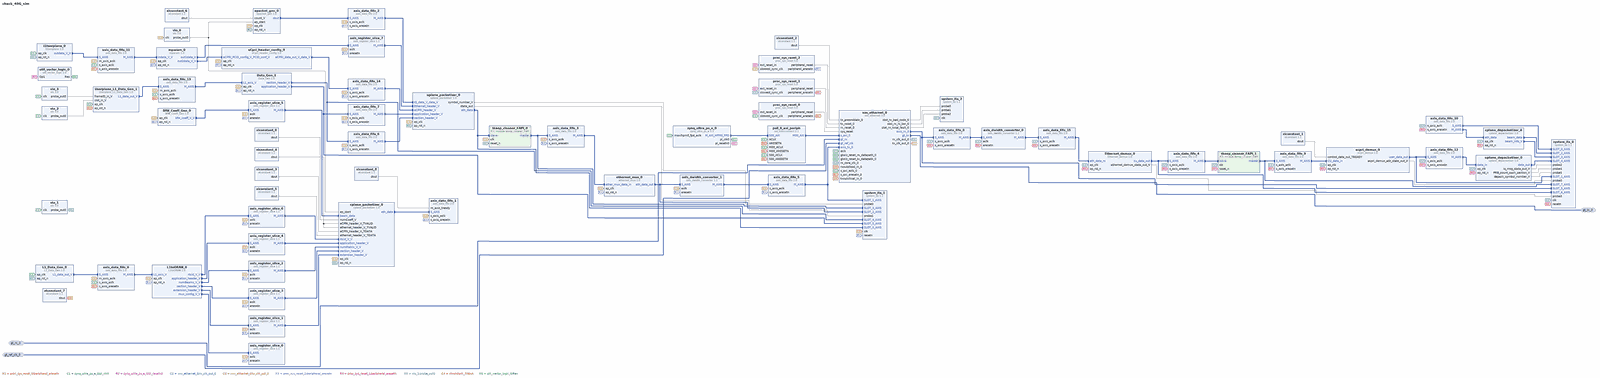
[diagram p0: block diagram of the top level, whole]
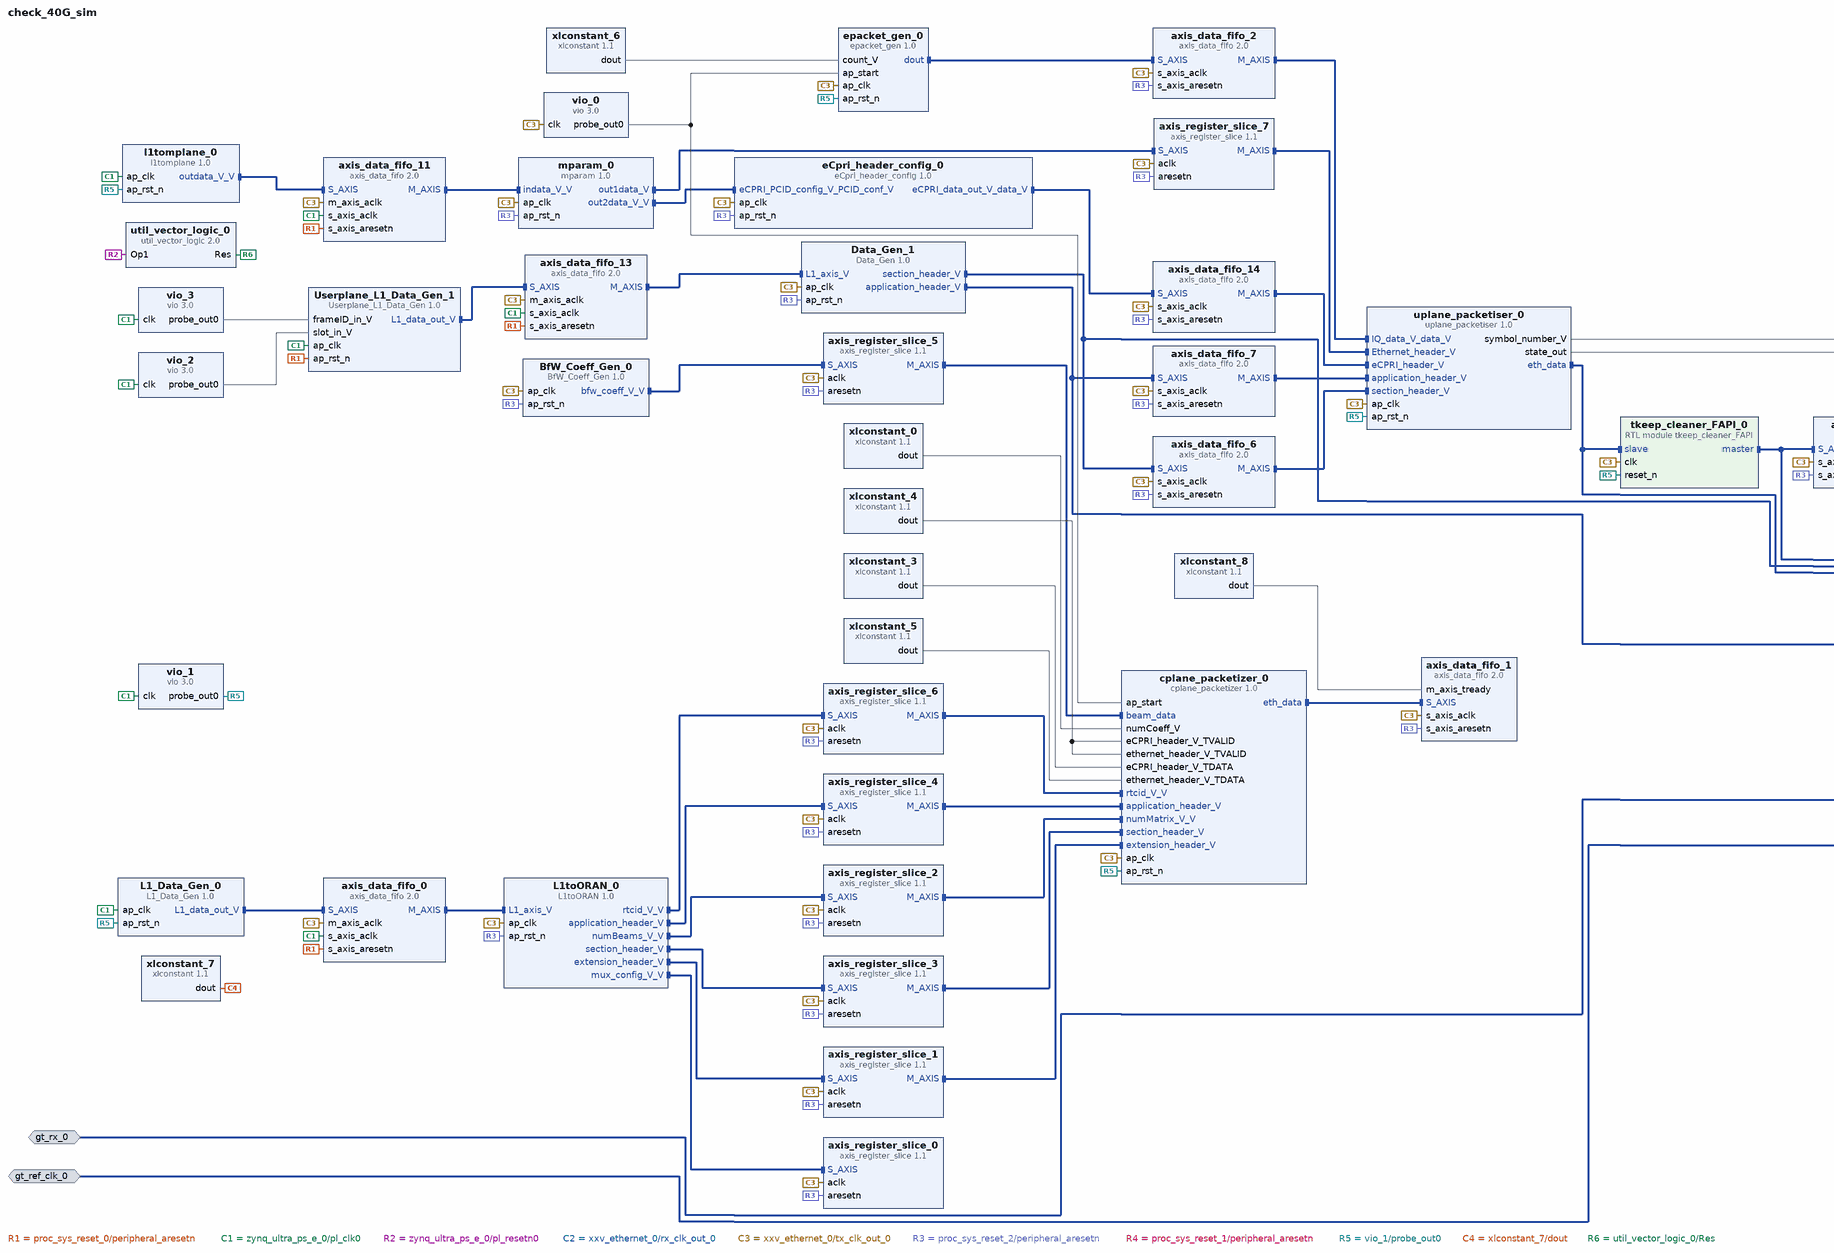
[diagram p1: block diagram of the top level, left part]
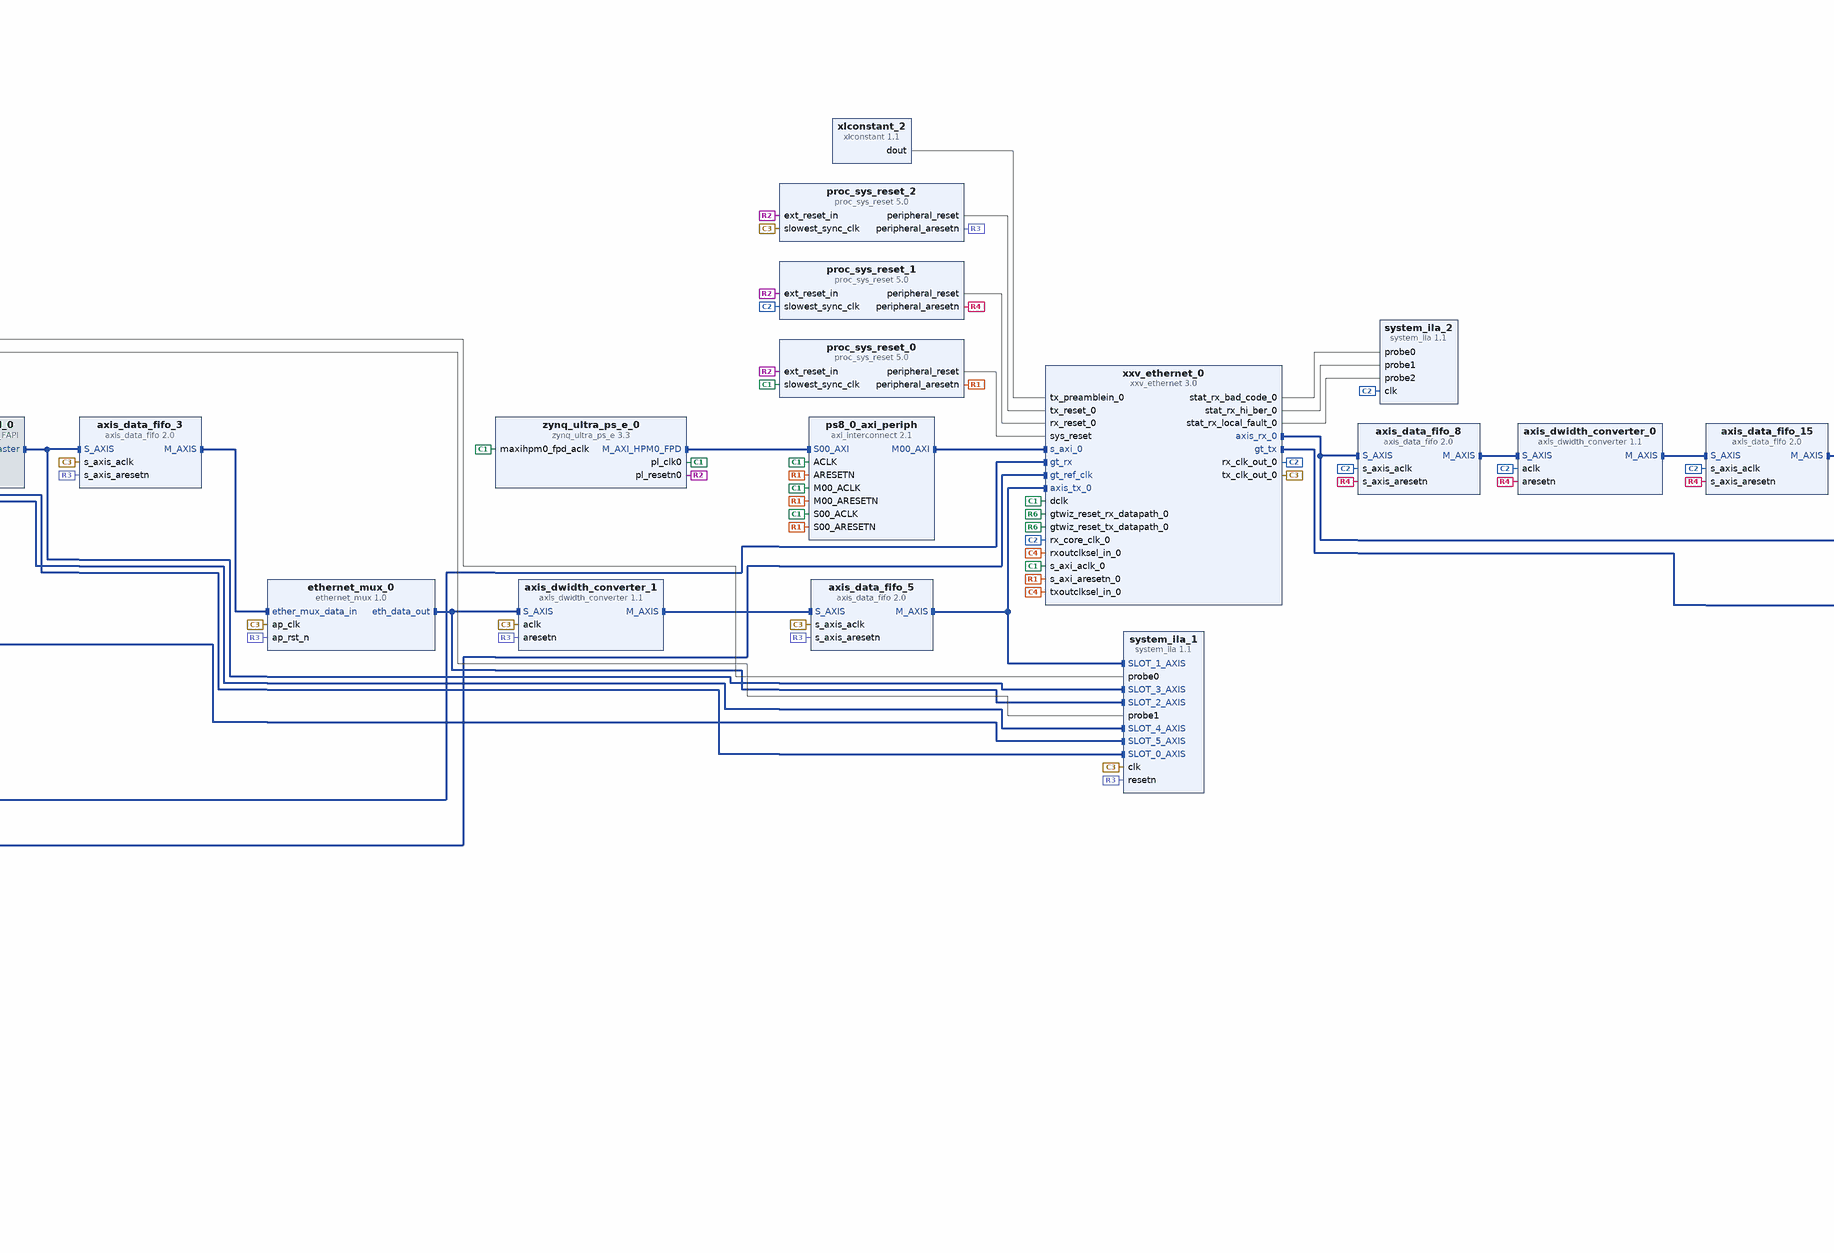
[diagram p2: block diagram of the top level, centre part]
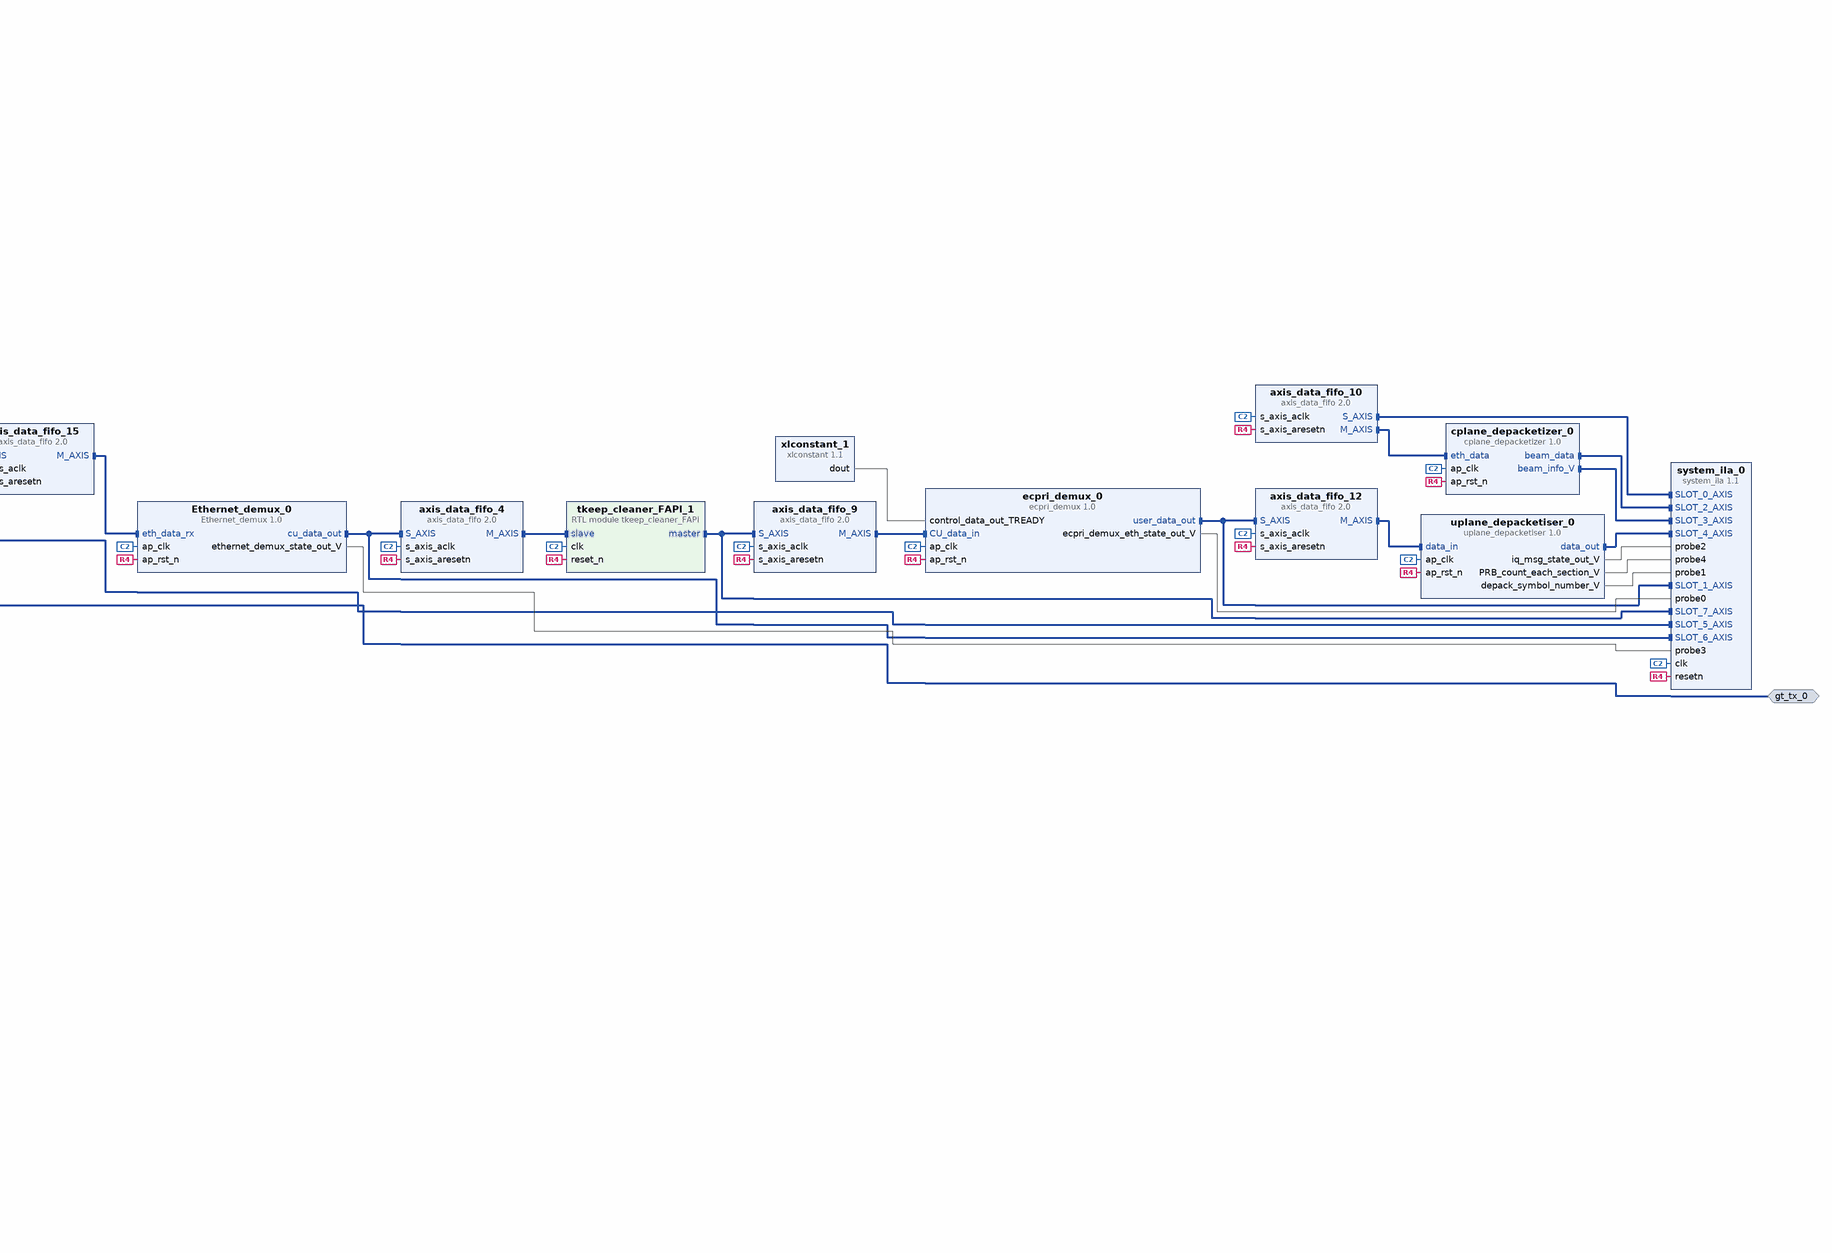
[diagram p3: block diagram of the top level, right part]
# Vivado block design check_40G_sim, xczu19eg-ffvd1760-3-e, Vivado 2019.1
create_bd_design check_40G_sim

create_bd_intf_port -mode Slave -vlnv xilinx.com:interface:diff_clock_rtl:1.0 gt_ref_clk_0
set_property -dict {CONFIG.FREQ_HZ 156250000} [get_bd_intf_ports gt_ref_clk_0]
create_bd_intf_port -mode Slave -vlnv xilinx.com:display_xxv_ethernet:gt_ports:2.0 gt_rx_0
create_bd_intf_port -mode Master -vlnv xilinx.com:display_xxv_ethernet:gt_ports:2.0 gt_tx_0

create_bd_cell -type ip -vlnv xilinx.com:ip:axis_data_fifo:2.0 axis_data_fifo_0
set_property -dict {CONFIG.FIFO_DEPTH 2048 CONFIG.IS_ACLK_ASYNC 1} [get_bd_cells axis_data_fifo_0]
create_bd_cell -type ip -vlnv xilinx.com:ip:axis_data_fifo:2.0 axis_data_fifo_11
set_property -dict {CONFIG.IS_ACLK_ASYNC 1} [get_bd_cells axis_data_fifo_11]
create_bd_cell -type ip -vlnv xilinx.com:ip:axis_data_fifo:2.0 axis_data_fifo_13
set_property -dict {CONFIG.IS_ACLK_ASYNC 1} [get_bd_cells axis_data_fifo_13]
create_bd_cell -type ip -vlnv xilinx.com:ip:axis_data_fifo:2.0 axis_data_fifo_14
create_bd_cell -type ip -vlnv xilinx.com:ip:axis_data_fifo:2.0 axis_data_fifo_1
set_property -dict {CONFIG.FIFO_DEPTH 4096 CONFIG.FIFO_MODE 1 CONFIG.HAS_TLAST 1} [get_bd_cells axis_data_fifo_1]
create_bd_cell -type ip -vlnv xilinx.com:ip:axis_data_fifo:2.0 axis_data_fifo_2
set_property -dict {CONFIG.FIFO_DEPTH 1024} [get_bd_cells axis_data_fifo_2]
create_bd_cell -type ip -vlnv xilinx.com:ip:axis_data_fifo:2.0 axis_data_fifo_3
set_property -dict {CONFIG.FIFO_DEPTH 4096 CONFIG.FIFO_MODE 1} [get_bd_cells axis_data_fifo_3]
create_bd_cell -type ip -vlnv xilinx.com:ip:axis_data_fifo:2.0 axis_data_fifo_6
set_property -dict {CONFIG.FIFO_DEPTH 1024} [get_bd_cells axis_data_fifo_6]
create_bd_cell -type ip -vlnv xilinx.com:ip:axis_data_fifo:2.0 axis_data_fifo_7
set_property -dict {CONFIG.FIFO_DEPTH 1024} [get_bd_cells axis_data_fifo_7]
create_bd_cell -type ip -vlnv xilinx.com:ip:axis_data_fifo:2.0 axis_data_fifo_9
set_property -dict {CONFIG.FIFO_DEPTH 512} [get_bd_cells axis_data_fifo_9]
create_bd_cell -type ip -vlnv xilinx.com:ip:axis_dwidth_converter:1.1 axis_dwidth_converter_1
set_property -dict [list \
  CONFIG.HAS_MI_TKEEP 0 \
  CONFIG.HAS_TKEEP 1 \
  CONFIG.HAS_TLAST 1 \
  CONFIG.M_TDATA_NUM_BYTES 8 \
  CONFIG.S_TDATA_NUM_BYTES 16 \
  CONFIG.TUSER_BITS_PER_BYTE 1 \
] [get_bd_cells axis_dwidth_converter_1]
create_bd_cell -type ip -vlnv xilinx.com:ip:axis_register_slice:1.1 axis_register_slice_0
create_bd_cell -type ip -vlnv xilinx.com:ip:axis_register_slice:1.1 axis_register_slice_1
create_bd_cell -type ip -vlnv xilinx.com:ip:axis_register_slice:1.1 axis_register_slice_2
create_bd_cell -type ip -vlnv xilinx.com:ip:axis_register_slice:1.1 axis_register_slice_3
create_bd_cell -type ip -vlnv xilinx.com:ip:axis_register_slice:1.1 axis_register_slice_4
create_bd_cell -type ip -vlnv xilinx.com:ip:axis_register_slice:1.1 axis_register_slice_5
create_bd_cell -type ip -vlnv xilinx.com:ip:axis_register_slice:1.1 axis_register_slice_6
create_bd_cell -type ip -vlnv xilinx.com:ip:axis_register_slice:1.1 axis_register_slice_7
create_bd_cell -type ip -vlnv xilinx.com:hls:epacket_gen:1.0 epacket_gen_0
create_bd_cell -type ip -vlnv xilinx.com:ip:proc_sys_reset:5.0 proc_sys_reset_0
create_bd_cell -type ip -vlnv xilinx.com:ip:proc_sys_reset:5.0 proc_sys_reset_1
create_bd_cell -type ip -vlnv xilinx.com:ip:proc_sys_reset:5.0 proc_sys_reset_2
create_bd_cell -type ip -vlnv xilinx.com:ip:axi_interconnect:2.1 ps8_0_axi_periph
set_property -dict {CONFIG.NUM_MI 1} [get_bd_cells ps8_0_axi_periph]
create_bd_cell -type ip -vlnv xilinx.com:ip:util_vector_logic:2.0 util_vector_logic_0
set_property -dict {CONFIG.C_OPERATION not CONFIG.C_SIZE 1} [get_bd_cells util_vector_logic_0]
create_bd_cell -type ip -vlnv xilinx.com:ip:vio:3.0 vio_0
set_property -dict {CONFIG.C_NUM_PROBE_IN 0} [get_bd_cells vio_0]
create_bd_cell -type ip -vlnv xilinx.com:ip:vio:3.0 vio_1
set_property -dict {CONFIG.C_NUM_PROBE_IN 0} [get_bd_cells vio_1]
create_bd_cell -type ip -vlnv xilinx.com:ip:xlconstant:1.1 xlconstant_0
set_property -dict {CONFIG.CONST_VAL 16 CONFIG.CONST_WIDTH 5} [get_bd_cells xlconstant_0]
create_bd_cell -type ip -vlnv xilinx.com:ip:xlconstant:1.1 xlconstant_3
set_property -dict {CONFIG.CONST_VAL 0x00000100000200 CONFIG.CONST_WIDTH 64} [get_bd_cells xlconstant_3]
create_bd_cell -type ip -vlnv xilinx.com:ip:xlconstant:1.1 xlconstant_4
create_bd_cell -type ip -vlnv xilinx.com:ip:xlconstant:1.1 xlconstant_5
set_property -dict {CONFIG.CONST_VAL 0xaefe000a35000001ffffffffffff CONFIG.CONST_WIDTH 112} [get_bd_cells xlconstant_5]
create_bd_cell -type ip -vlnv xilinx.com:ip:xlconstant:1.1 xlconstant_6
set_property -dict {CONFIG.CONST_VAL 100 CONFIG.CONST_WIDTH 16} [get_bd_cells xlconstant_6]
create_bd_cell -type ip -vlnv xilinx.com:ip:zynq_ultra_ps_e:3.3 zynq_ultra_ps_e_0
set_property -dict [list \
  CONFIG.PSU__DDRC__ENABLE 0 \
  CONFIG.PSU__DDR_HIGH_ADDRESS_GUI_ENABLE 0 \
  CONFIG.PSU__DDR__INTERFACE__FREQMHZ 333.333 \
  CONFIG.PSU__MAXIGP0__DATA_WIDTH 128 \
  CONFIG.PSU__PSS_REF_CLK__FREQMHZ 50 \
  CONFIG.PSU__UART0__BAUD_RATE 115200 \
  CONFIG.PSU__UART0__MODEM__ENABLE 0 \
  CONFIG.PSU__UART0__PERIPHERAL__ENABLE 1 \
  CONFIG.PSU__UART0__PERIPHERAL__IO {MIO 18 .. 19} \
  CONFIG.PSU__USE__M_AXI_GP0 1 \
  CONFIG.PSU__USE__M_AXI_GP2 0 \
  CONFIG.SUBPRESET1 Custom \
] [get_bd_cells zynq_ultra_ps_e_0]
# 47 more settings of zynq_ultra_ps_e_0 are not shown: defaults, MIO pin electricals, DDR timing, and values the tool derives
create_bd_cell -type ip -vlnv xilinx.com:hls:BfW_Coeff_Gen:1.0 BfW_Coeff_Gen_0
create_bd_cell -type ip -vlnv xilinx.com:hls:L1_Data_Gen:1.0 L1_Data_Gen_0
create_bd_cell -type ip -vlnv xilinx.com:hls:cplane_packetizer:1.0 cplane_packetizer_0
create_bd_cell -type ip -vlnv xilinx.com:ip:system_ila:1.1 system_ila_0
set_property -dict [list \
  CONFIG.ALL_PROBE_SAME_MU_CNT 2 \
  CONFIG.C_DATA_DEPTH 4096 \
  CONFIG.C_EN_STRG_QUAL 1 \
  CONFIG.C_MON_TYPE MIX \
  CONFIG.C_NUM_MONITOR_SLOTS 8 \
  CONFIG.C_NUM_OF_PROBES 5 \
  CONFIG.C_PROBE0_MU_CNT 2 \
  CONFIG.C_PROBE1_MU_CNT 2 \
  CONFIG.C_PROBE2_MU_CNT 2 \
  CONFIG.C_PROBE3_MU_CNT 2 \
  CONFIG.C_PROBE4_MU_CNT 2 \
  CONFIG.C_PROBE5_MU_CNT 2 \
  CONFIG.C_SLOT 7 \
  CONFIG.C_SLOT_0_INTF_TYPE xilinx.com:interface:axis_rtl:1.0 \
  CONFIG.C_SLOT_1_INTF_TYPE xilinx.com:interface:axis_rtl:1.0 \
  CONFIG.C_SLOT_2_INTF_TYPE xilinx.com:interface:axis_rtl:1.0 \
  CONFIG.C_SLOT_3_INTF_TYPE xilinx.com:interface:axis_rtl:1.0 \
  CONFIG.C_SLOT_4_INTF_TYPE xilinx.com:interface:axis_rtl:1.0 \
  CONFIG.C_SLOT_5_INTF_TYPE xilinx.com:interface:axis_rtl:1.0 \
  CONFIG.C_SLOT_6_INTF_TYPE xilinx.com:interface:axis_rtl:1.0 \
  CONFIG.C_SLOT_7_INTF_TYPE xilinx.com:interface:axis_rtl:1.0 \
] [get_bd_cells system_ila_0]
create_bd_cell -type ip -vlnv xilinx.com:hls:cplane_depacketizer:1.0 cplane_depacketizer_0
create_bd_cell -type ip -vlnv xilinx.com:ip:axis_data_fifo:2.0 axis_data_fifo_10
set_property -dict {CONFIG.FIFO_DEPTH 1024} [get_bd_cells axis_data_fifo_10]
create_bd_cell -type ip -vlnv xilinx.com:ip:axis_data_fifo:2.0 axis_data_fifo_12
set_property -dict {CONFIG.FIFO_DEPTH 1024} [get_bd_cells axis_data_fifo_12]
create_bd_cell -type ip -vlnv xilinx.com:ip:xxv_ethernet:3.0 xxv_ethernet_0
set_property -dict [list \
  CONFIG.BASE_R_KR BASE-R \
  CONFIG.ENABLE_PIPELINE_REG 1 \
  CONFIG.GT_GROUP_SELECT Quad_X0Y3 \
  CONFIG.GT_REF_CLK_FREQ 156.25 \
  CONFIG.GT_TYPE GTH \
  CONFIG.INCLUDE_AXI4_INTERFACE 1 \
  CONFIG.INCLUDE_STATISTICS_COUNTERS 1 \
  CONFIG.INS_LOSS_NYQ 10 \
  CONFIG.LANE1_GT_LOC X0Y12 \
  CONFIG.LINE_RATE 10 \
] [get_bd_cells xxv_ethernet_0]
create_bd_cell -type ip -vlnv xilinx.com:ip:axis_data_fifo:2.0 axis_data_fifo_5
set_property -dict {CONFIG.FIFO_DEPTH 4096 CONFIG.FIFO_MODE 2} [get_bd_cells axis_data_fifo_5]
create_bd_cell -type ip -vlnv xilinx.com:ip:xlconstant:1.1 xlconstant_2
set_property -dict {CONFIG.CONST_VAL 0 CONFIG.CONST_WIDTH 56} [get_bd_cells xlconstant_2]
create_bd_cell -type ip -vlnv xilinx.com:ip:axis_dwidth_converter:1.1 axis_dwidth_converter_0
set_property -dict {CONFIG.M_TDATA_NUM_BYTES 16 CONFIG.S_TDATA_NUM_BYTES 8} [get_bd_cells axis_dwidth_converter_0]
create_bd_cell -type ip -vlnv xilinx.com:ip:axis_data_fifo:2.0 axis_data_fifo_8
set_property -dict {CONFIG.FIFO_DEPTH 1024} [get_bd_cells axis_data_fifo_8]
create_bd_cell -type ip -vlnv xilinx.com:ip:xlconstant:1.1 xlconstant_7
set_property -dict {CONFIG.CONST_VAL 5 CONFIG.CONST_WIDTH 3} [get_bd_cells xlconstant_7]
create_bd_cell -type ip -vlnv xilinx.com:ip:system_ila:1.1 system_ila_1
set_property -dict [list \
  CONFIG.ALL_PROBE_SAME_MU_CNT 2 \
  CONFIG.C_DATA_DEPTH 4096 \
  CONFIG.C_EN_STRG_QUAL 1 \
  CONFIG.C_MON_TYPE MIX \
  CONFIG.C_NUM_MONITOR_SLOTS 6 \
  CONFIG.C_NUM_OF_PROBES 2 \
  CONFIG.C_PROBE0_MU_CNT 2 \
  CONFIG.C_PROBE1_MU_CNT 2 \
  CONFIG.C_PROBE2_MU_CNT 2 \
  CONFIG.C_PROBE3_MU_CNT 2 \
  CONFIG.C_SLOT 5 \
  CONFIG.C_SLOT_0_INTF_TYPE xilinx.com:interface:axis_rtl:1.0 \
  CONFIG.C_SLOT_1_INTF_TYPE xilinx.com:interface:axis_rtl:1.0 \
  CONFIG.C_SLOT_2_INTF_TYPE xilinx.com:interface:axis_rtl:1.0 \
  CONFIG.C_SLOT_3_INTF_TYPE xilinx.com:interface:axis_rtl:1.0 \
  CONFIG.C_SLOT_4_INTF_TYPE xilinx.com:interface:axis_rtl:1.0 \
  CONFIG.C_SLOT_5_INTF_TYPE xilinx.com:interface:axis_rtl:1.0 \
] [get_bd_cells system_ila_1]
create_bd_cell -type ip -vlnv xilinx.com:hls:L1toORAN:1.0 L1toORAN_0
create_bd_cell -type ip -vlnv xilinx.com:hls:ecpri_demux:1.0 ecpri_demux_0
create_bd_cell -type ip -vlnv xilinx.com:ip:system_ila:1.1 system_ila_2
set_property -dict {CONFIG.C_MON_TYPE NATIVE CONFIG.C_NUM_OF_PROBES 3} [get_bd_cells system_ila_2]
create_bd_cell -type ip -vlnv xilinx.com:ip:xlconstant:1.1 xlconstant_8
create_bd_cell -type module -reference tkeep_cleaner_FAPI tkeep_cleaner_FAPI_0
create_bd_cell -type module -reference tkeep_cleaner_FAPI tkeep_cleaner_FAPI_1
create_bd_cell -type ip -vlnv xilinx.com:ip:axis_data_fifo:2.0 axis_data_fifo_4
set_property -dict [list \
  CONFIG.FIFO_DEPTH 1024 \
  CONFIG.HAS_TKEEP 1 \
  CONFIG.HAS_TLAST 1 \
  CONFIG.TDATA_NUM_BYTES 16 \
] [get_bd_cells axis_data_fifo_4]
create_bd_cell -type ip -vlnv xilinx.com:ip:xlconstant:1.1 xlconstant_1
create_bd_cell -type ip -vlnv xilinx.com:ip:axis_data_fifo:2.0 axis_data_fifo_15
set_property -dict {CONFIG.FIFO_DEPTH 1024} [get_bd_cells axis_data_fifo_15]
create_bd_cell -type ip -vlnv xilinx.com:hls:Ethernet_demux:1.0 Ethernet_demux_0
create_bd_cell -type ip -vlnv xilinx.com:hls:ethernet_mux:1.0 ethernet_mux_0
create_bd_cell -type ip -vlnv xilinx.com:hls:uplane_depacketiser:1.0 uplane_depacketiser_0
create_bd_cell -type ip -vlnv xilinx.com:hls:Userplane_L1_Data_Gen:1.0 Userplane_L1_Data_Gen_1
create_bd_cell -type ip -vlnv xilinx.com:hls:eCpri_header_config:1.0 eCpri_header_config_0
create_bd_cell -type ip -vlnv xilinx.com:hls:l1tomplane:1.0 l1tomplane_0
create_bd_cell -type ip -vlnv xilinx.com:hls:mparam:1.0 mparam_0
create_bd_cell -type ip -vlnv xilinx.com:hls:Data_Gen:1.0 Data_Gen_1
create_bd_cell -type ip -vlnv xilinx.com:hls:uplane_packetiser:1.0 uplane_packetiser_0
create_bd_cell -type ip -vlnv xilinx.com:ip:vio:3.0 vio_2
set_property -dict {CONFIG.C_NUM_PROBE_IN 0 CONFIG.C_PROBE_OUT0_WIDTH 6} [get_bd_cells vio_2]
create_bd_cell -type ip -vlnv xilinx.com:ip:vio:3.0 vio_3
set_property -dict {CONFIG.C_NUM_PROBE_IN 0 CONFIG.C_PROBE_OUT0_WIDTH 8} [get_bd_cells vio_3]

# ---- connections ----

connect_bd_intf_net [get_bd_intf_pins tkeep_cleaner_FAPI_1/master] [get_bd_intf_pins axis_data_fifo_9/S_AXIS]
connect_bd_intf_net [get_bd_intf_pins tkeep_cleaner_FAPI_1/master] [get_bd_intf_pins system_ila_0/SLOT_7_AXIS]
connect_bd_intf_net [get_bd_intf_pins tkeep_cleaner_FAPI_0/master] [get_bd_intf_pins axis_data_fifo_3/S_AXIS]
connect_bd_intf_net [get_bd_intf_pins tkeep_cleaner_FAPI_0/master] [get_bd_intf_pins system_ila_1/SLOT_3_AXIS]
connect_bd_intf_net [get_bd_intf_pins axis_data_fifo_4/M_AXIS] [get_bd_intf_pins tkeep_cleaner_FAPI_1/slave]
connect_bd_intf_net [get_bd_intf_pins L1_Data_Gen_0/L1_data_out_V] [get_bd_intf_pins axis_data_fifo_0/S_AXIS]
connect_bd_intf_net [get_bd_intf_pins BfW_Coeff_Gen_0/bfw_coeff_V_V] [get_bd_intf_pins axis_register_slice_5/S_AXIS]
connect_bd_intf_net [get_bd_intf_pins ethernet_mux_0/eth_data_out] [get_bd_intf_pins axis_dwidth_converter_1/S_AXIS]
connect_bd_intf_net [get_bd_intf_pins ethernet_mux_0/eth_data_out] [get_bd_intf_pins system_ila_1/SLOT_2_AXIS]
connect_bd_intf_net [get_bd_intf_pins mparam_0/out2data_V_V] [get_bd_intf_pins eCpri_header_config_0/eCPRI_PCID_config_V_PCID_conf_V]
connect_bd_intf_net [get_bd_intf_pins l1tomplane_0/outdata_V_V] [get_bd_intf_pins axis_data_fifo_11/S_AXIS]
connect_bd_intf_net [get_bd_intf_pins axis_data_fifo_11/M_AXIS] [get_bd_intf_pins mparam_0/indata_V_V]
connect_bd_intf_net [get_bd_intf_pins L1toORAN_0/section_header_V] [get_bd_intf_pins axis_register_slice_3/S_AXIS]
connect_bd_intf_net [get_bd_intf_pins axis_register_slice_7/M_AXIS] [get_bd_intf_pins uplane_packetiser_0/Ethernet_header_V]
connect_bd_intf_net [get_bd_intf_pins uplane_packetiser_0/application_header_V] [get_bd_intf_pins axis_data_fifo_7/M_AXIS]
connect_bd_intf_net [get_bd_intf_pins cplane_packetizer_0/eth_data] [get_bd_intf_pins axis_data_fifo_1/S_AXIS]
connect_bd_intf_net -intf_net Data_Gen_1_application_header [get_bd_intf_pins axis_data_fifo_6/S_AXIS] [get_bd_intf_pins Data_Gen_1/section_header_V]
connect_bd_intf_net [get_bd_intf_pins axis_data_fifo_6/S_AXIS] [get_bd_intf_pins system_ila_1/SLOT_4_AXIS]
connect_bd_intf_net [get_bd_intf_pins axis_dwidth_converter_0/M_AXIS] [get_bd_intf_pins axis_data_fifo_15/S_AXIS]
connect_bd_intf_net -intf_net Data_Gen_1_section_header [get_bd_intf_pins axis_data_fifo_7/S_AXIS] [get_bd_intf_pins Data_Gen_1/application_header_V]
connect_bd_intf_net [get_bd_intf_pins axis_data_fifo_7/S_AXIS] [get_bd_intf_pins system_ila_1/SLOT_5_AXIS]
connect_bd_intf_net [get_bd_intf_pins uplane_packetiser_0/section_header_V] [get_bd_intf_pins axis_data_fifo_6/M_AXIS]
connect_bd_intf_net [get_bd_intf_pins L1toORAN_0/numBeams_V_V] [get_bd_intf_pins axis_register_slice_2/S_AXIS]
connect_bd_intf_net [get_bd_intf_pins ps8_0_axi_periph/M00_AXI] [get_bd_intf_pins xxv_ethernet_0/s_axi_0]
connect_bd_intf_net [get_bd_intf_pins ecpri_demux_0/user_data_out] [get_bd_intf_pins axis_data_fifo_12/S_AXIS]
connect_bd_intf_net [get_bd_intf_pins ecpri_demux_0/user_data_out] [get_bd_intf_pins system_ila_0/SLOT_1_AXIS]
connect_bd_intf_net [get_bd_intf_pins axis_data_fifo_12/M_AXIS] [get_bd_intf_pins uplane_depacketiser_0/data_in]
connect_bd_intf_net [get_bd_intf_pins zynq_ultra_ps_e_0/M_AXI_HPM0_FPD] [get_bd_intf_pins ps8_0_axi_periph/S00_AXI]
connect_bd_intf_net [get_bd_intf_pins L1toORAN_0/rtcid_V_V] [get_bd_intf_pins axis_register_slice_6/S_AXIS]
connect_bd_intf_net [get_bd_intf_pins mparam_0/out1data_V] [get_bd_intf_pins axis_register_slice_7/S_AXIS]
connect_bd_intf_net [get_bd_intf_pins axis_register_slice_6/M_AXIS] [get_bd_intf_pins cplane_packetizer_0/rtcid_V_V]
connect_bd_intf_net [get_bd_intf_pins axis_data_fifo_14/M_AXIS] [get_bd_intf_pins uplane_packetiser_0/eCPRI_header_V]
connect_bd_intf_net [get_bd_intf_pins axis_data_fifo_9/M_AXIS] [get_bd_intf_pins ecpri_demux_0/CU_data_in]
connect_bd_intf_net [get_bd_intf_pins axis_register_slice_2/M_AXIS] [get_bd_intf_pins cplane_packetizer_0/numMatrix_V_V]
connect_bd_intf_net [get_bd_intf_pins eCpri_header_config_0/eCPRI_data_out_V_data_V] [get_bd_intf_pins axis_data_fifo_14/S_AXIS]
connect_bd_intf_net -intf_net ecpri_demux_0_control_data_out [get_bd_intf_pins axis_data_fifo_10/S_AXIS] [get_bd_intf_pins system_ila_0/SLOT_0_AXIS]
connect_bd_intf_net [get_bd_intf_pins cplane_depacketizer_0/beam_data] [get_bd_intf_pins system_ila_0/SLOT_2_AXIS]
connect_bd_intf_net [get_bd_intf_pins axis_data_fifo_15/M_AXIS] [get_bd_intf_pins Ethernet_demux_0/eth_data_rx]
connect_bd_intf_net [get_bd_intf_pins axis_data_fifo_8/M_AXIS] [get_bd_intf_pins axis_dwidth_converter_0/S_AXIS]
connect_bd_intf_net [get_bd_intf_pins cplane_depacketizer_0/beam_info_V] [get_bd_intf_pins system_ila_0/SLOT_3_AXIS]
connect_bd_intf_net [get_bd_intf_pins axis_data_fifo_10/M_AXIS] [get_bd_intf_pins cplane_depacketizer_0/eth_data]
connect_bd_intf_net [get_bd_intf_pins uplane_depacketiser_0/data_out] [get_bd_intf_pins system_ila_0/SLOT_4_AXIS]
connect_bd_intf_net [get_bd_intf_pins L1toORAN_0/extension_header_V] [get_bd_intf_pins axis_register_slice_1/S_AXIS]
connect_bd_intf_net [get_bd_intf_pins axis_register_slice_4/M_AXIS] [get_bd_intf_pins cplane_packetizer_0/application_header_V]
connect_bd_intf_net [get_bd_intf_pins axis_data_fifo_0/M_AXIS] [get_bd_intf_pins L1toORAN_0/L1_axis_V]
connect_bd_intf_net [get_bd_intf_pins Userplane_L1_Data_Gen_1/L1_data_out_V] [get_bd_intf_pins axis_data_fifo_13/S_AXIS]
connect_bd_intf_net [get_bd_intf_pins axis_data_fifo_5/M_AXIS] [get_bd_intf_pins xxv_ethernet_0/axis_tx_0]
connect_bd_intf_net [get_bd_intf_pins axis_data_fifo_5/M_AXIS] [get_bd_intf_pins system_ila_1/SLOT_1_AXIS]
connect_bd_intf_net [get_bd_intf_pins xxv_ethernet_0/axis_rx_0] [get_bd_intf_pins axis_data_fifo_8/S_AXIS]
connect_bd_intf_net [get_bd_intf_pins xxv_ethernet_0/axis_rx_0] [get_bd_intf_pins system_ila_0/SLOT_5_AXIS]
connect_bd_intf_net [get_bd_intf_ports gt_tx_0] [get_bd_intf_pins xxv_ethernet_0/gt_tx]
connect_bd_intf_net -intf_net gt_rx_0_1 [get_bd_intf_ports gt_rx_0] [get_bd_intf_pins xxv_ethernet_0/gt_rx]
connect_bd_intf_net -intf_net gt_ref_clk_0_1 [get_bd_intf_ports gt_ref_clk_0] [get_bd_intf_pins xxv_ethernet_0/gt_ref_clk]
connect_bd_intf_net [get_bd_intf_pins axis_dwidth_converter_1/M_AXIS] [get_bd_intf_pins axis_data_fifo_5/S_AXIS]
connect_bd_intf_net [get_bd_intf_pins axis_register_slice_3/M_AXIS] [get_bd_intf_pins cplane_packetizer_0/section_header_V]
connect_bd_intf_net [get_bd_intf_pins axis_data_fifo_2/M_AXIS] [get_bd_intf_pins uplane_packetiser_0/IQ_data_V_data_V]
connect_bd_intf_net [get_bd_intf_pins axis_register_slice_1/M_AXIS] [get_bd_intf_pins cplane_packetizer_0/extension_header_V]
connect_bd_intf_net [get_bd_intf_pins axis_register_slice_5/M_AXIS] [get_bd_intf_pins cplane_packetizer_0/beam_data]
connect_bd_intf_net [get_bd_intf_pins axis_data_fifo_13/M_AXIS] [get_bd_intf_pins Data_Gen_1/L1_axis_V]
connect_bd_intf_net [get_bd_intf_pins epacket_gen_0/dout] [get_bd_intf_pins axis_data_fifo_2/S_AXIS]
connect_bd_intf_net [get_bd_intf_pins uplane_packetiser_0/eth_data] [get_bd_intf_pins tkeep_cleaner_FAPI_0/slave]
connect_bd_intf_net [get_bd_intf_pins uplane_packetiser_0/eth_data] [get_bd_intf_pins system_ila_1/SLOT_0_AXIS]
connect_bd_intf_net [get_bd_intf_pins axis_data_fifo_3/M_AXIS] [get_bd_intf_pins ethernet_mux_0/ether_mux_data_in]
connect_bd_intf_net [get_bd_intf_pins L1toORAN_0/mux_config_V_V] [get_bd_intf_pins axis_register_slice_0/S_AXIS]
connect_bd_intf_net [get_bd_intf_pins L1toORAN_0/application_header_V] [get_bd_intf_pins axis_register_slice_4/S_AXIS]
connect_bd_intf_net [get_bd_intf_pins axis_data_fifo_4/S_AXIS] [get_bd_intf_pins Ethernet_demux_0/cu_data_out]
connect_bd_intf_net [get_bd_intf_pins axis_data_fifo_4/S_AXIS] [get_bd_intf_pins system_ila_0/SLOT_6_AXIS]
connect_bd_net [get_bd_pins proc_sys_reset_0/peripheral_aresetn] \
  [get_bd_pins axis_data_fifo_0/s_axis_aresetn] [get_bd_pins axis_data_fifo_11/s_axis_aresetn] \
  [get_bd_pins axis_data_fifo_13/s_axis_aresetn] [get_bd_pins ps8_0_axi_periph/ARESETN] \
  [get_bd_pins ps8_0_axi_periph/S00_ARESETN] [get_bd_pins ps8_0_axi_periph/M00_ARESETN] \
  [get_bd_pins xxv_ethernet_0/s_axi_aresetn_0] [get_bd_pins Userplane_L1_Data_Gen_1/ap_rst_n]
connect_bd_net [get_bd_pins zynq_ultra_ps_e_0/pl_clk0] \
  [get_bd_pins axis_data_fifo_0/s_axis_aclk] [get_bd_pins axis_data_fifo_11/s_axis_aclk] \
  [get_bd_pins axis_data_fifo_13/s_axis_aclk] [get_bd_pins proc_sys_reset_0/slowest_sync_clk] \
  [get_bd_pins ps8_0_axi_periph/ACLK] [get_bd_pins ps8_0_axi_periph/S00_ACLK] [get_bd_pins ps8_0_axi_periph/M00_ACLK] \
  [get_bd_pins vio_1/clk] [get_bd_pins zynq_ultra_ps_e_0/maxihpm0_fpd_aclk] [get_bd_pins L1_Data_Gen_0/ap_clk] \
  [get_bd_pins xxv_ethernet_0/s_axi_aclk_0] [get_bd_pins xxv_ethernet_0/dclk] [get_bd_pins Userplane_L1_Data_Gen_1/ap_clk] \
  [get_bd_pins l1tomplane_0/ap_clk] [get_bd_pins vio_3/clk] [get_bd_pins vio_2/clk]
connect_bd_net [get_bd_pins zynq_ultra_ps_e_0/pl_resetn0] \
  [get_bd_pins proc_sys_reset_0/ext_reset_in] [get_bd_pins proc_sys_reset_1/ext_reset_in] \
  [get_bd_pins proc_sys_reset_2/ext_reset_in] [get_bd_pins util_vector_logic_0/Op1]
connect_bd_net -net l_ethernet_0_rx_clk_out_0 [get_bd_pins xxv_ethernet_0/rx_clk_out_0] \
  [get_bd_pins axis_data_fifo_9/s_axis_aclk] [get_bd_pins proc_sys_reset_1/slowest_sync_clk] [get_bd_pins system_ila_0/clk] \
  [get_bd_pins axis_data_fifo_10/s_axis_aclk] [get_bd_pins cplane_depacketizer_0/ap_clk] \
  [get_bd_pins axis_data_fifo_12/s_axis_aclk] [get_bd_pins axis_data_fifo_8/s_axis_aclk] \
  [get_bd_pins axis_dwidth_converter_0/aclk] [get_bd_pins xxv_ethernet_0/rx_core_clk_0] [get_bd_pins ecpri_demux_0/ap_clk] \
  [get_bd_pins system_ila_2/clk] [get_bd_pins axis_data_fifo_4/s_axis_aclk] [get_bd_pins tkeep_cleaner_FAPI_1/clk] \
  [get_bd_pins axis_data_fifo_15/s_axis_aclk] [get_bd_pins Ethernet_demux_0/ap_clk] \
  [get_bd_pins uplane_depacketiser_0/ap_clk]
connect_bd_net -net l_ethernet_0_tx_clk_out_0 [get_bd_pins xxv_ethernet_0/tx_clk_out_0] \
  [get_bd_pins axis_data_fifo_0/m_axis_aclk] [get_bd_pins axis_data_fifo_11/m_axis_aclk] \
  [get_bd_pins axis_data_fifo_13/m_axis_aclk] [get_bd_pins axis_data_fifo_14/s_axis_aclk] \
  [get_bd_pins axis_data_fifo_1/s_axis_aclk] [get_bd_pins axis_data_fifo_2/s_axis_aclk] \
  [get_bd_pins axis_data_fifo_3/s_axis_aclk] [get_bd_pins axis_data_fifo_6/s_axis_aclk] \
  [get_bd_pins axis_data_fifo_7/s_axis_aclk] [get_bd_pins axis_dwidth_converter_1/aclk] \
  [get_bd_pins axis_register_slice_0/aclk] [get_bd_pins axis_register_slice_1/aclk] [get_bd_pins axis_register_slice_2/aclk] \
  [get_bd_pins axis_register_slice_3/aclk] [get_bd_pins axis_register_slice_4/aclk] [get_bd_pins axis_register_slice_5/aclk] \
  [get_bd_pins axis_register_slice_6/aclk] [get_bd_pins axis_register_slice_7/aclk] [get_bd_pins epacket_gen_0/ap_clk] \
  [get_bd_pins proc_sys_reset_2/slowest_sync_clk] [get_bd_pins vio_0/clk] [get_bd_pins BfW_Coeff_Gen_0/ap_clk] \
  [get_bd_pins cplane_packetizer_0/ap_clk] [get_bd_pins axis_data_fifo_5/s_axis_aclk] [get_bd_pins system_ila_1/clk] \
  [get_bd_pins L1toORAN_0/ap_clk] [get_bd_pins tkeep_cleaner_FAPI_0/clk] [get_bd_pins ethernet_mux_0/ap_clk] \
  [get_bd_pins eCpri_header_config_0/ap_clk] [get_bd_pins mparam_0/ap_clk] [get_bd_pins Data_Gen_1/ap_clk] \
  [get_bd_pins uplane_packetiser_0/ap_clk]
connect_bd_net -net xlconstant_2_dout [get_bd_pins vio_0/probe_out0] [get_bd_pins epacket_gen_0/ap_start] [get_bd_pins cplane_packetizer_0/ap_start]
connect_bd_net [get_bd_pins proc_sys_reset_2/peripheral_aresetn] \
  [get_bd_pins axis_data_fifo_14/s_axis_aresetn] [get_bd_pins axis_data_fifo_1/s_axis_aresetn] \
  [get_bd_pins axis_data_fifo_2/s_axis_aresetn] [get_bd_pins axis_data_fifo_3/s_axis_aresetn] \
  [get_bd_pins axis_data_fifo_6/s_axis_aresetn] [get_bd_pins axis_data_fifo_7/s_axis_aresetn] \
  [get_bd_pins axis_dwidth_converter_1/aresetn] [get_bd_pins axis_register_slice_0/aresetn] \
  [get_bd_pins axis_register_slice_1/aresetn] [get_bd_pins axis_register_slice_2/aresetn] \
  [get_bd_pins axis_register_slice_3/aresetn] [get_bd_pins axis_register_slice_4/aresetn] \
  [get_bd_pins axis_register_slice_5/aresetn] [get_bd_pins axis_register_slice_6/aresetn] \
  [get_bd_pins axis_register_slice_7/aresetn] [get_bd_pins BfW_Coeff_Gen_0/ap_rst_n] \
  [get_bd_pins axis_data_fifo_5/s_axis_aresetn] [get_bd_pins system_ila_1/resetn] [get_bd_pins L1toORAN_0/ap_rst_n] \
  [get_bd_pins ethernet_mux_0/ap_rst_n] [get_bd_pins eCpri_header_config_0/ap_rst_n] [get_bd_pins mparam_0/ap_rst_n] \
  [get_bd_pins Data_Gen_1/ap_rst_n]
connect_bd_net [get_bd_pins xlconstant_0/dout] [get_bd_pins cplane_packetizer_0/numCoeff_V]
connect_bd_net [get_bd_pins xlconstant_4/dout] \
  [get_bd_pins cplane_packetizer_0/ethernet_header_V_TVALID] [get_bd_pins cplane_packetizer_0/eCPRI_header_V_TVALID]
connect_bd_net [get_bd_pins xlconstant_3/dout] [get_bd_pins cplane_packetizer_0/eCPRI_header_V_TDATA]
connect_bd_net [get_bd_pins xlconstant_5/dout] [get_bd_pins cplane_packetizer_0/ethernet_header_V_TDATA]
connect_bd_net [get_bd_pins xlconstant_6/dout] [get_bd_pins epacket_gen_0/count_V]
connect_bd_net [get_bd_pins proc_sys_reset_1/peripheral_aresetn] \
  [get_bd_pins axis_data_fifo_9/s_axis_aresetn] [get_bd_pins system_ila_0/resetn] \
  [get_bd_pins axis_data_fifo_10/s_axis_aresetn] [get_bd_pins cplane_depacketizer_0/ap_rst_n] \
  [get_bd_pins axis_data_fifo_12/s_axis_aresetn] [get_bd_pins axis_data_fifo_8/s_axis_aresetn] \
  [get_bd_pins axis_dwidth_converter_0/aresetn] [get_bd_pins ecpri_demux_0/ap_rst_n] \
  [get_bd_pins axis_data_fifo_4/s_axis_aresetn] [get_bd_pins tkeep_cleaner_FAPI_1/reset_n] \
  [get_bd_pins axis_data_fifo_15/s_axis_aresetn] [get_bd_pins Ethernet_demux_0/ap_rst_n] \
  [get_bd_pins uplane_depacketiser_0/ap_rst_n]
connect_bd_net [get_bd_pins vio_1/probe_out0] \
  [get_bd_pins epacket_gen_0/ap_rst_n] [get_bd_pins L1_Data_Gen_0/ap_rst_n] [get_bd_pins cplane_packetizer_0/ap_rst_n] \
  [get_bd_pins tkeep_cleaner_FAPI_0/reset_n] [get_bd_pins l1tomplane_0/ap_rst_n] [get_bd_pins uplane_packetiser_0/ap_rst_n]
connect_bd_net [get_bd_pins ecpri_demux_0/ecpri_demux_eth_state_out_V] [get_bd_pins system_ila_0/probe0]
connect_bd_net [get_bd_pins uplane_depacketiser_0/iq_msg_state_out_V] [get_bd_pins system_ila_0/probe2]
connect_bd_net [get_bd_pins xlconstant_2/dout] [get_bd_pins xxv_ethernet_0/tx_preamblein_0]
connect_bd_net [get_bd_pins proc_sys_reset_2/peripheral_reset] [get_bd_pins xxv_ethernet_0/tx_reset_0]
connect_bd_net [get_bd_pins proc_sys_reset_1/peripheral_reset] [get_bd_pins xxv_ethernet_0/rx_reset_0]
connect_bd_net [get_bd_pins xlconstant_7/dout] [get_bd_pins xxv_ethernet_0/txoutclksel_in_0] [get_bd_pins xxv_ethernet_0/rxoutclksel_in_0]
connect_bd_net [get_bd_pins util_vector_logic_0/Res] \
  [get_bd_pins xxv_ethernet_0/gtwiz_reset_tx_datapath_0] [get_bd_pins xxv_ethernet_0/gtwiz_reset_rx_datapath_0]
connect_bd_net [get_bd_pins proc_sys_reset_0/peripheral_reset] [get_bd_pins xxv_ethernet_0/sys_reset]
connect_bd_net [get_bd_pins uplane_packetiser_0/symbol_number_V] [get_bd_pins system_ila_1/probe0]
connect_bd_net [get_bd_pins xxv_ethernet_0/stat_rx_bad_code_0] [get_bd_pins system_ila_2/probe0]
connect_bd_net [get_bd_pins xxv_ethernet_0/stat_rx_hi_ber_0] [get_bd_pins system_ila_2/probe1]
connect_bd_net [get_bd_pins xxv_ethernet_0/stat_rx_local_fault_0] [get_bd_pins system_ila_2/probe2]
connect_bd_net -net uplane_packetiser_0_App_frag_V [get_bd_pins uplane_packetiser_0/state_out] [get_bd_pins system_ila_1/probe1]
connect_bd_net [get_bd_pins xlconstant_8/dout] [get_bd_pins axis_data_fifo_1/m_axis_tready]
connect_bd_net [get_bd_pins xlconstant_1/dout] [get_bd_pins ecpri_demux_0/control_data_out_TREADY]
connect_bd_net [get_bd_pins uplane_depacketiser_0/PRB_count_each_section_V] [get_bd_pins system_ila_0/probe4]
connect_bd_net [get_bd_pins uplane_depacketiser_0/depack_symbol_number_V] [get_bd_pins system_ila_0/probe1]
connect_bd_net [get_bd_pins Ethernet_demux_0/ethernet_demux_state_out_V] [get_bd_pins system_ila_0/probe3]
connect_bd_net [get_bd_pins vio_3/probe_out0] [get_bd_pins Userplane_L1_Data_Gen_1/frameID_in_V]
connect_bd_net [get_bd_pins vio_2/probe_out0] [get_bd_pins Userplane_L1_Data_Gen_1/slot_in_V]

# ---- address map ----
assign_bd_address -offset 0x00A0000000 -range 4K -target_address_space [get_bd_addr_spaces zynq_ultra_ps_e_0/Data] [get_bd_addr_segs xxv_ethernet_0/s_axi_0/Reg]

validate_bd_design
save_bd_design
